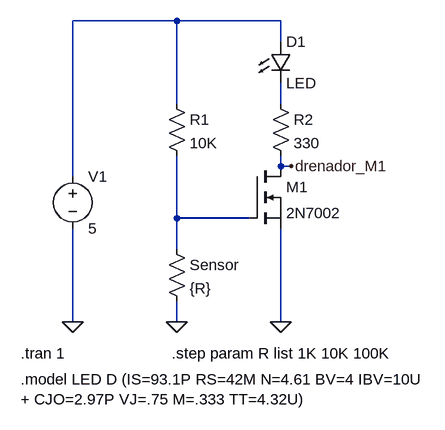
[diagram p0: schematic control-humedad.asc]
control-humedad.asc, the LTspice schematic file:
Version 4
SHEET 1 880 680
WIRE -32 -96 -192 -96
WIRE 128 -96 -32 -96
WIRE 128 -64 128 -96
WIRE -32 32 -32 -96
WIRE 128 32 128 0
WIRE 128 128 128 112
WIRE 144 128 128 128
WIRE -192 144 -192 -96
WIRE -32 208 -32 112
WIRE 80 208 -32 208
WIRE -32 256 -32 208
WIRE -192 368 -192 224
WIRE -32 368 -32 336
WIRE 128 368 128 224
FLAG -32 368 0
FLAG 128 368 0
FLAG -192 368 0
FLAG 144 128 drenador_M1
SYMBOL nmos 80 128 R0
SYMATTR InstName M1
SYMATTR Value 2N7002
SYMBOL res -48 16 R0
SYMATTR InstName R1
SYMATTR Value 10K
SYMBOL res 112 16 R0
SYMATTR InstName R2
SYMATTR Value 330
SYMBOL res -48 240 R0
SYMATTR InstName Sensor
SYMATTR Value {R}
SYMBOL voltage -192 128 R0
WINDOW 123 0 0 Left 0
WINDOW 39 0 0 Left 0
SYMATTR InstName V1
SYMATTR Value 5
SYMBOL LED 112 -64 R0
SYMATTR InstName D1
SYMATTR Value LED
TEXT -272 456 Left 2 !.model LED D (IS=93.1P RS=42M N=4.61 BV=4 IBV=10U\n+ CJO=2.97P VJ=.75 M=.333 TT=4.32U)
TEXT -40 416 Left 2 !.step param R list 1K 10K 100K
TEXT -272 416 Left 2 !.tran 1

The netlist it stands for:
* control-humedad.asc
M1 drenador_M1 N003 0 0 2N7002
R1 N001 N003 10K
R2 N002 drenador_M1 330
R§Sensor N003 0 {R}
V1 N001 0 5
D1 N001 N002 LED
.model D D
.lib standard.dio
.model NMOS NMOS
.model PMOS PMOS
.lib standard.mos
.model LED D (IS=93.1P RS=42M N=4.61 BV=4 IBV=10U
+ CJO=2.97P VJ=.75 M=.333 TT=4.32U)
.step param R list 1K 10K 100K
.tran 1
.backanno
.end